# Altium schematic sheet STM32F103Core.SchDoc: STM32F103C8T6核心板
size A3; Revision: 1.0
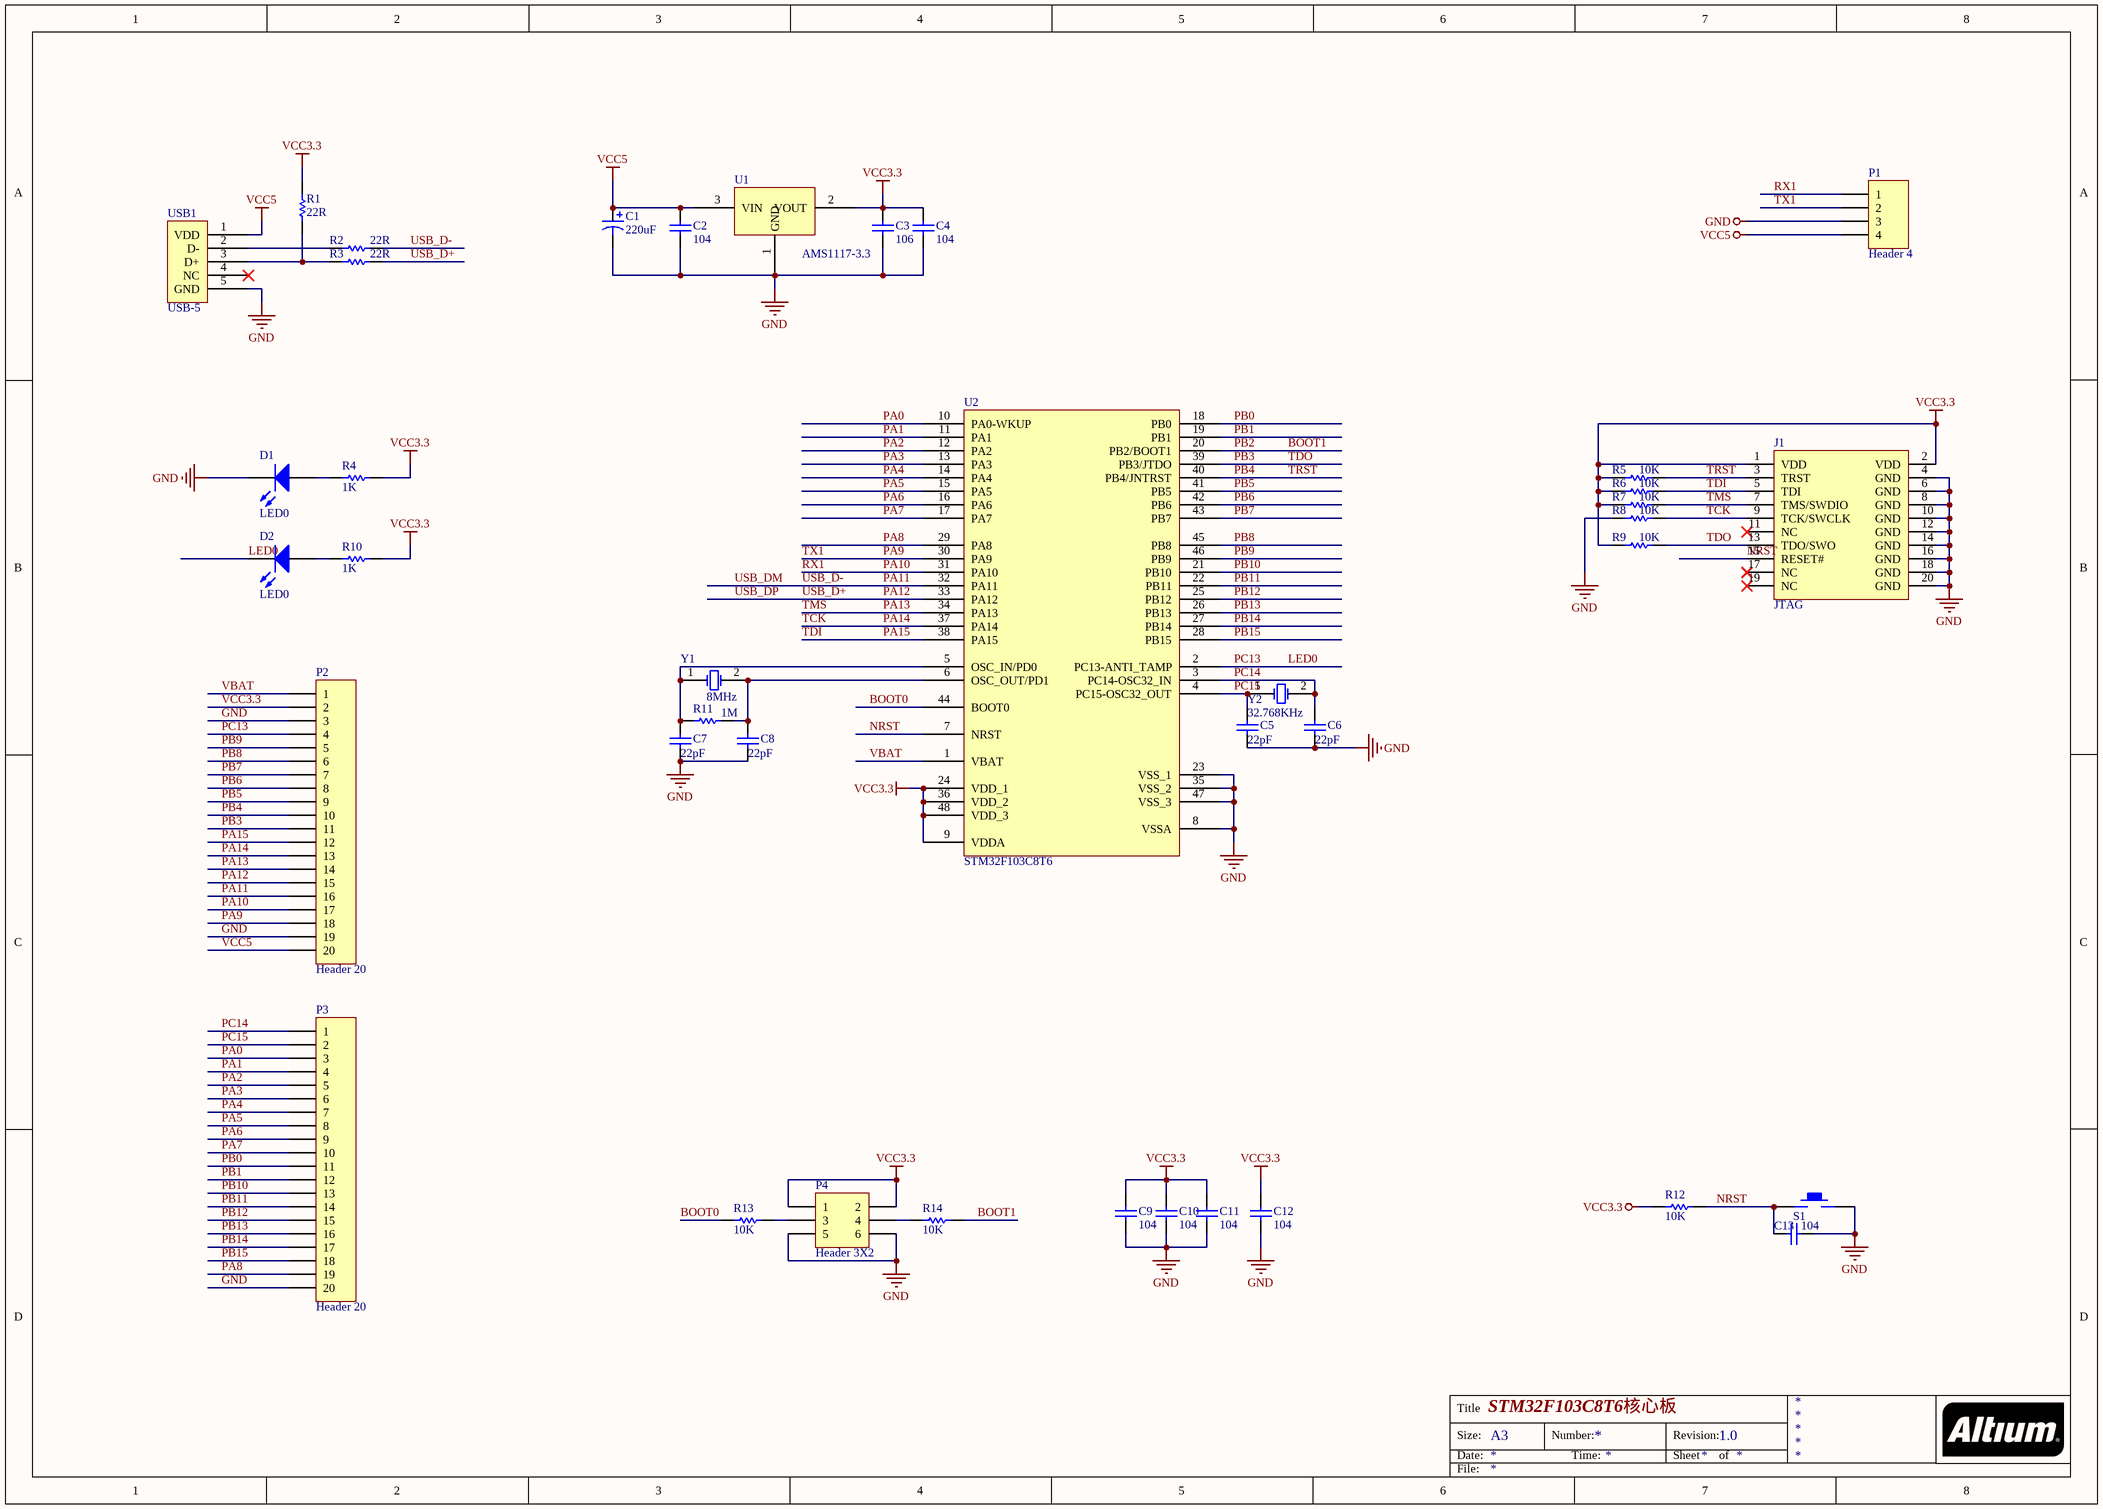
[diagram p0: STM32F103Core.SchDoc]

## Parts
C1  220uF  [TAJ-B]
C2  104  [C0805]
C3  106  [C0805]
C4  104  [C0805]
C5  22pF  [C0805]
C6  22pF  [C0805]
C7  22pF  [C0805]
C8  22pF  [C0805]
C9  104  [C0805]
C10  104  [C0805]
C11  104  [C0805]
C12  104  [C0805]
C13  104  [C0805]
D1  LED0  [LED0805]
D2  LED0  [LED0805]
J1  JTAG  [DC3-20P-W]
P1  Header 4  [HDR1X4]
P2  Header 20  [HDR1X20]
P3  Header 20  [HDR1X20]
P4  Header 3X2  [HDR2X3]
R1  22R  [R0805]
R2  22R  [R0805]
R3  22R  [R0805]
R4  1K  [R0805]
R5  10K  [R0805]
R6  10K  [R0805]
R7  10K  [R0805]
R8  10K  [R0805]
R9  10K  [R0805]
R10  1K  [R0805]
R11  1M  [R0805]
R12  10K  [R0805]
R13  10K  [R0805]
R14  10K  [R0805]
S1  KEY  [DSW-KFC-022S-H2.5]  (value not drawn)
U1  AMS1117-3.3  [SOT-223]
U2  STM32F103C8T6  [LQFP48_L]
USB1  USB-5  [USB-MicroUSB]
Y1  8MHz  [49SMD]
Y2  32.768KHz  [MC146]

## Nets
GND: C1.2 C2.1 C3.1 C4.1 C5.1 C6.1 C7.1 C8.1 C9.1 C10.1 C11.1 C12.1 C13.2 D1.2(K) J1.4(GND) J1.6(GND) J1.8(GND) J1.10(GND) J1.12(GND) J1.14(GND) J1.16(GND) J1.18(GND) J1.20(GND) P1.3 P2.3 P2.19 P3.20 P4.5 P4.6 R8.1 S1.2 U1.1(GND) U2.8(VSSA) U2.23(VSS_1) U2.35(VSS_2) U2.47(VSS_3) USB1.5(GND)
VCC3.3: C3.2 C4.2 C9.2 C10.2 C11.2 C12.2 J1.1(VDD) J1.2(VDD) P2.2 P4.1 P4.2 R1.2 R4.2 R5.1 R6.1 R7.1 R9.1 R10.2 R12.2 U1.2(VOUT) U2.9(VDDA) U2.24(VDD_1) U2.36(VDD_2) U2.48(VDD_3)
VCC5: C1.1 C2.2 P1.4 P2.20 U1.3(VIN) USB1.1(VDD)
BOOT0: R13.1 U2.44(BOOT0)
BOOT1: R14.2 U2.20(PB2/BOOT1)  [also labelled PB2]
LED0: D2.2(K) P2.4 U2.2(PC13-ANTI_TAMP)  [also labelled PC13]
NRST: C13.1 J1.15(RESET#) R12.1 S1.1 U2.7(NRST)
PA0: P3.3 U2.10(PA0-WKUP)
PA1: P3.4 U2.11(PA1)
PA2: P3.5 U2.12(PA2)
PA3: P3.6 U2.13(PA3)
PA4: P3.7 U2.14(PA4)
PA5: P3.8 U2.15(PA5)
PA6: P3.9 U2.16(PA6)
PA7: P3.10 U2.17(PA7)
PA8: P3.19 U2.29(PA8)
PA9: P1.2 P2.18 U2.30(PA9)  [also labelled TX1]
PA10: P1.1 P2.17 U2.31(PA10)  [also labelled RX1]
PA11: P2.16 R2.2 U2.32(PA11)  [also labelled USB_D-, USB_DM]
PA12: P2.15 R3.2 U2.33(PA12)  [also labelled USB_D+, USB_DP]
PA13: J1.7(TMS/SWDIO) P2.14 R7.2 U2.34(PA13)  [also labelled TMS]
PA14: J1.9(TCK/SWCLK) P2.13 R8.2 U2.37(PA14)  [also labelled TCK]
PA15: J1.5(TDI) P2.12 R6.2 U2.38(PA15)  [also labelled TDI]
PB0: P3.11 U2.18(PB0)
PB1: P3.12 U2.19(PB1)
PB3: J1.13(TDO/SWO) P2.11 R9.2 U2.39(PB3/JTDO)  [also labelled TDO]
PB4: J1.3(TRST) P2.10 R5.2 U2.40(PB4/JNTRST)  [also labelled TRST]
PB5: P2.9 U2.41(PB5)
PB6: P2.8 U2.42(PB6)
PB7: P2.7 U2.43(PB7)
PB8: P2.6 U2.45(PB8)
PB9: P2.5 U2.46(PB9)
PB10: P3.13 U2.21(PB10)
PB11: P3.14 U2.22(PB11)
PB12: P3.15 U2.25(PB12)
PB13: P3.16 U2.26(PB13)
PB14: P3.17 U2.27(PB14)
PB15: P3.18 U2.28(PB15)
PC14: C6.2 P3.1 U2.3(PC14-OSC32_IN) Y2.2(OSC2)
PC15: C5.2 P3.2 U2.4(PC15-OSC32_OUT) Y2.1(OSC1)
VBAT: P2.1 U2.1(VBAT)
NetC7_2: C7.2 R11.1 U2.5(OSC_IN/PD0) Y1.1(OSC1)
NetC8_2: C8.2 R11.2 U2.6(OSC_OUT/PD1) Y1.2(OSC2)
NetD1_1: D1.1(A) R4.1
NetD2_1: D2.1(A) R10.1
NetP4_3: P4.3 R13.2
NetP4_4: P4.4 R14.1
NetR1_1: R1.1 R3.1 USB1.3(D+)
NetR2_1: R2.1 USB1.2(D-)

Not connected (* = marked no-connect by the designer): J1 11(NC)* 17(NC)* 19(NC)*; USB1 4(NC)*

## Notes on the sheet
- Title
- Size:
- Date:
- A3
- Number:
- Time:
- Revision:
- Sheet
- of
- File:

## Library data of the parts
C1 = Cap Pol2: Value: 100pF; Published: 8-Jun-2000; LatestRevisionDate: 17-Jul-2002; LatestRevisionNote: Re-released for DXP Platform.; PackageReference: POLAR0.8; Publisher: Altium Limited; PackageDescription: Polarized Capacitor; 2 Leads
C2-C13 = C: Capacitor; Value: 100pF; Published: 8-Jun-2000; LatestRevisionDate: 17-Jul-2002; LatestRevisionNote: Re-released for DXP Platform.; PackageReference: RAD-0.3; Publisher: Altium Limited; PackageDescription: Radial Cap, Thru-Hole; 2 Leads; 0.3 in Pin Spacing
D1 D2 = LED0: Typical INFRARED GaAs LED; Published: 8-Jun-2000; LatestRevisionDate: 08-Jul-2005; LatestRevisionNote: Mech Layer 1 removed.; PackageReference: LED-0; Publisher: Altium Limited; PackageDescription: LED; 2 Leads
P1 = Header 4: Header, 4-Pin; LatestRevisionDate: 17-Jul-2002; LatestRevisionNote: Re-released for DXP Platform.; Publisher: Altium Limited
P2 P3 = Header 20: Header, 20-Pin; LatestRevisionDate: 17-Jul-2002; LatestRevisionNote: Re-released for DXP Platform.; Publisher: Altium Limited
P4 = Header 3X2: Header, 3-Pin, Dual row; LatestRevisionDate: 17-Jul-2002; LatestRevisionNote: Re-released for DXP Platform.; Publisher: Altium Limited
R1-R3 R5-R9 R11-R14 = R: Resistor; Value: 1K; Published: 8-Jun-2000; LatestRevisionDate: 17-Jul-2002; LatestRevisionNote: Re-released for DXP Platform.; PackageReference: AXIAL-0.3; Publisher: Altium Limited; PackageDescription: Axial Device, Thru-Hole; 2 Leads; 0.3 in Pin Spacing
R4 R10 = R: Resistor; Published: 8-Jun-2000; LatestRevisionDate: 17-Jul-2002; LatestRevisionNote: Re-released for DXP Platform.; PackageReference: AXIAL-0.3; Publisher: Altium Limited; PackageDescription: Axial Device, Thru-Hole; 2 Leads; 0.3 in Pin Spacing; Value: 1K
S1 = KEY: 普通轻触按钮
U1 = AMS1117
Y1 Y2 = XTAL: Crystal Oscillator; Published: 8-Jun-2000; LatestRevisionDate: 17-Jul-2002; LatestRevisionNote: Re-released for DXP Platform.; PackageReference: R38; Publisher: Altium Limited; PackageDescription: Crystal, Thru-Hole; 2 Leads; Body 3.1 x 8.2 mm (Dia.xH)